# Altium schematic sheet Differential Amplifier.SchDoc
size A4
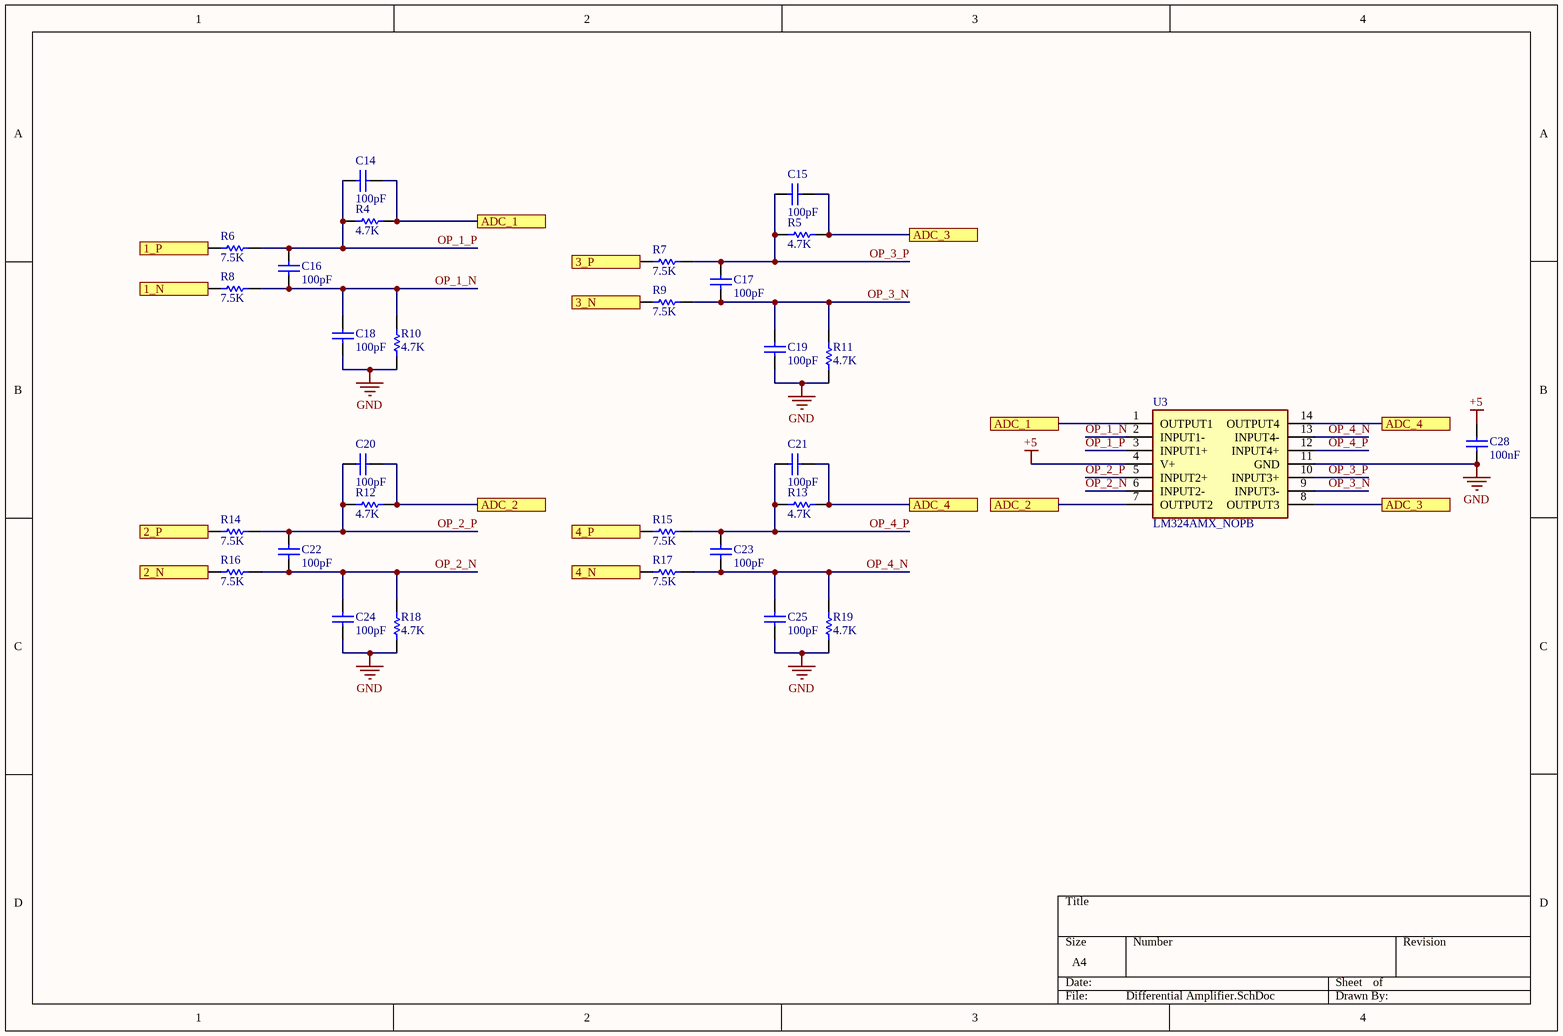
[diagram p0: Differential Amplifier.SchDoc]

## Parts
C14  value 100pF  [C0805]  (hidden comment: 10V)
C15  value 100pF  [C0805]  (hidden comment: 10V)
C16  value 100pF  [C0805]  (hidden comment: 10V)
C17  value 100pF  [C0805]  (hidden comment: 10V)
C18  value 100pF  [C0805]  (hidden comment: 10V)
C19  value 100pF  [C0805]  (hidden comment: 10V)
C20  value 100pF  [C0805]  (hidden comment: 10V)
C21  value 100pF  [C0805]  (hidden comment: 10V)
C22  value 100pF  [C0805]  (hidden comment: 10V)
C23  value 100pF  [C0805]  (hidden comment: 10V)
C24  value 100pF  [C0805]  (hidden comment: 10V)
C25  value 100pF  [C0805]  (hidden comment: 10V)
C28  value 100nF  [C0805]  (hidden comment: 10V)
R4  value 4.7K  [J1-0603]  (hidden comment: 5%)
R5  value 4.7K  [J1-0603]  (hidden comment: 5%)
R6  value 7.5K  [J1-0603]  (hidden comment: 5%)
R7  value 7.5K  [J1-0603]  (hidden comment: 5%)
R8  value 7.5K  [J1-0603]  (hidden comment: 5%)
R9  value 7.5K  [J1-0603]  (hidden comment: 5%)
R10  value 4.7K  [J1-0603]  (hidden comment: 5%)
R11  value 4.7K  [J1-0603]  (hidden comment: 5%)
R12  value 4.7K  [J1-0603]  (hidden comment: 5%)
R13  value 4.7K  [J1-0603]  (hidden comment: 5%)
R14  value 7.5K  [J1-0603]  (hidden comment: 5%)
R15  value 7.5K  [J1-0603]  (hidden comment: 5%)
R16  value 7.5K  [J1-0603]  (hidden comment: 5%)
R17  value 7.5K  [J1-0603]  (hidden comment: 5%)
R18  value 4.7K  [J1-0603]  (hidden comment: 5%)
R19  value 4.7K  [J1-0603]  (hidden comment: 5%)
U3  LM324AMX_NOPB  [SOIC127P600X175-14N - duplicate]

## Ports
1_N, 1_P, 2_N, 2_P, 3_N, 3_P, 4_N, 4_P, ADC_1, ADC_2, ADC_3, ADC_4

## Nets
+5: C28.1 U3.4(V+)
GND: C18.1 C19.1 C24.1 C25.1 C28.2 R10.2 R11.2 R18.2 R19.2 U3.11(GND)
1_N: R8.2 ; port 1_N
1_P: R6.2 ; port 1_P
2_N: R16.2 ; port 2_N
2_P: R14.2 ; port 2_P
3_N: R9.2 ; port 3_N
3_P: R7.2 ; port 3_P
4_N: R17.2 ; port 4_N
4_P: R15.2 ; port 4_P
ADC_1: C14.2 R4.1 U3.1(OUTPUT1) ; port ADC_1
ADC_2: C20.2 R12.1 U3.7(OUTPUT2) ; port ADC_2
ADC_3: C15.1 R5.1 U3.8(OUTPUT3) ; port ADC_3
ADC_4: C21.1 R13.1 U3.14(OUTPUT4) ; port ADC_4
OP_1_N: C16.1 C18.2 R8.1 R10.1 U3.2(INPUT1-)
OP_1_P: C14.1 C16.2 R4.2 R6.1 U3.3(INPUT1+)
OP_2_N: C22.1 C24.2 R16.1 R18.1 U3.6(INPUT2-)
OP_2_P: C20.1 C22.2 R12.2 R14.1 U3.5(INPUT2+)
OP_3_N: C17.1 C19.2 R9.1 R11.1 U3.9(INPUT3-)
OP_3_P: C15.2 C17.2 R5.2 R7.1 U3.10(INPUT3+)
OP_4_N: C23.1 C25.2 R17.1 R19.1 U3.13(INPUT4-)
OP_4_P: C21.2 C23.2 R13.2 R15.1 U3.12(INPUT4+)

## Library data of the parts
C14-C25 C28 = Cap: C0805C104K8RACTU. 0.1µF ±10% 10V Ceramic Capacitor X7R 0805 (2012 Metric) /; Published: 8-Jun-2000; LatestRevisionDate: 17-Jul-2002; LatestRevisionNote: Re-released for DXP Platform.; PackageReference: RAD-0.3; Publisher: Altium Limited; PackageDescription: Radial Cap, Thru-Hole; 2 Leads; 0.3 in Pin Spacing
R4-R19 = Res1: ERJ-3GEYJ103V. 10 kOhms ±5% 0.1W, 1/10W Chip Resistor 0603 (1608 Metric) Automotive AEC-Q200 Thick Film /; Published: 8-Jun-2000; LatestRevisionDate: 17-Jul-2002; LatestRevisionNote: Re-released for DXP Platform.; PackageReference: AXIAL-0.3; Publisher: Altium Limited; PackageDescription: Axial Device, Thru-Hole; 2 Leads; 0.3 in Pin Spacing
U3 = LM324AMX_NOPB: Integrated Circuit; Manufacturer_Name: Texas Instruments; Manufacturer_Part_Number: LM324AMX/NOPB; Datasheet Link: http://www.ti.com/lit/ds/symlink/lm124-n.pdf; Height: 1.75mm; Arrow Part Number: LM324AMX/NOPB; Arrow Price/Stock: https://www.arrow.com/en/products/lm324amxnopb/texas-instruments; Mouser Part Number: 926-LM324AMX/NOPB; Mouser Price/Stock: https://www.mouser.co.uk/ProductDetail/Texas-Instruments/LM324AMX-NOPB?qs=X1J7HmVL2ZGoShKBIiyAoQ%3D%3D